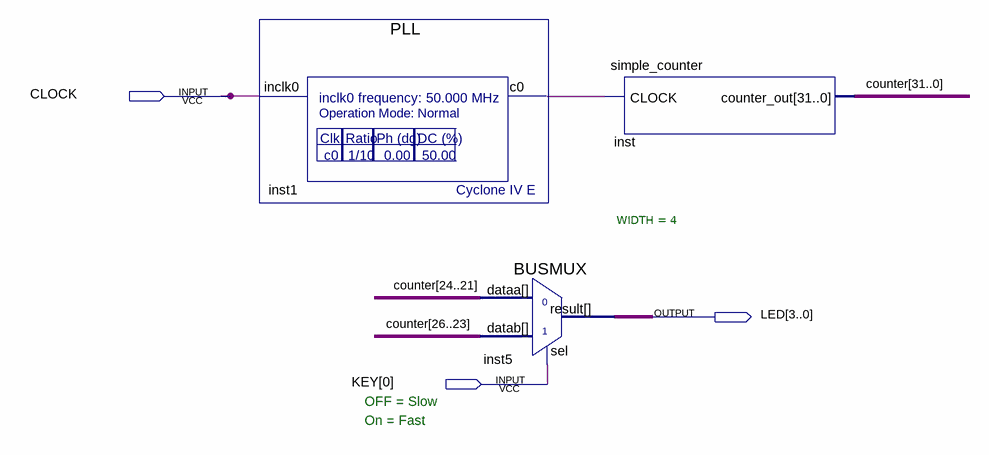
[diagram p0: schematic sheet]
// Quartus schematic my_first_fpga.bdf as structural Verilog: 3 symbols, 3 pins
module my_first_fpga (
  input  CLOCK,
  input  [0:0] KEY,
  output [3:0] LED
);

  wire inst1_c0;
  wire [31:0] counter;

  PLL inst1 (.inclk0(CLOCK), .c0(inst1_c0));
  BUSMUX #(.WIDTH(4)) inst5 (.datab(counter[26:23]), .sel(KEY[0]), .dataa(counter[24:21]), .result(LED));
  simple_counter inst (.CLOCK(inst1_c0), .counter_out(counter));

  // Notes on the sheet:
  //   OFF = Slow
  //   On = Fast
endmodule
